# EAGLE design NodeMCU-Lora-Gateway (EAGLE 7.6.0)
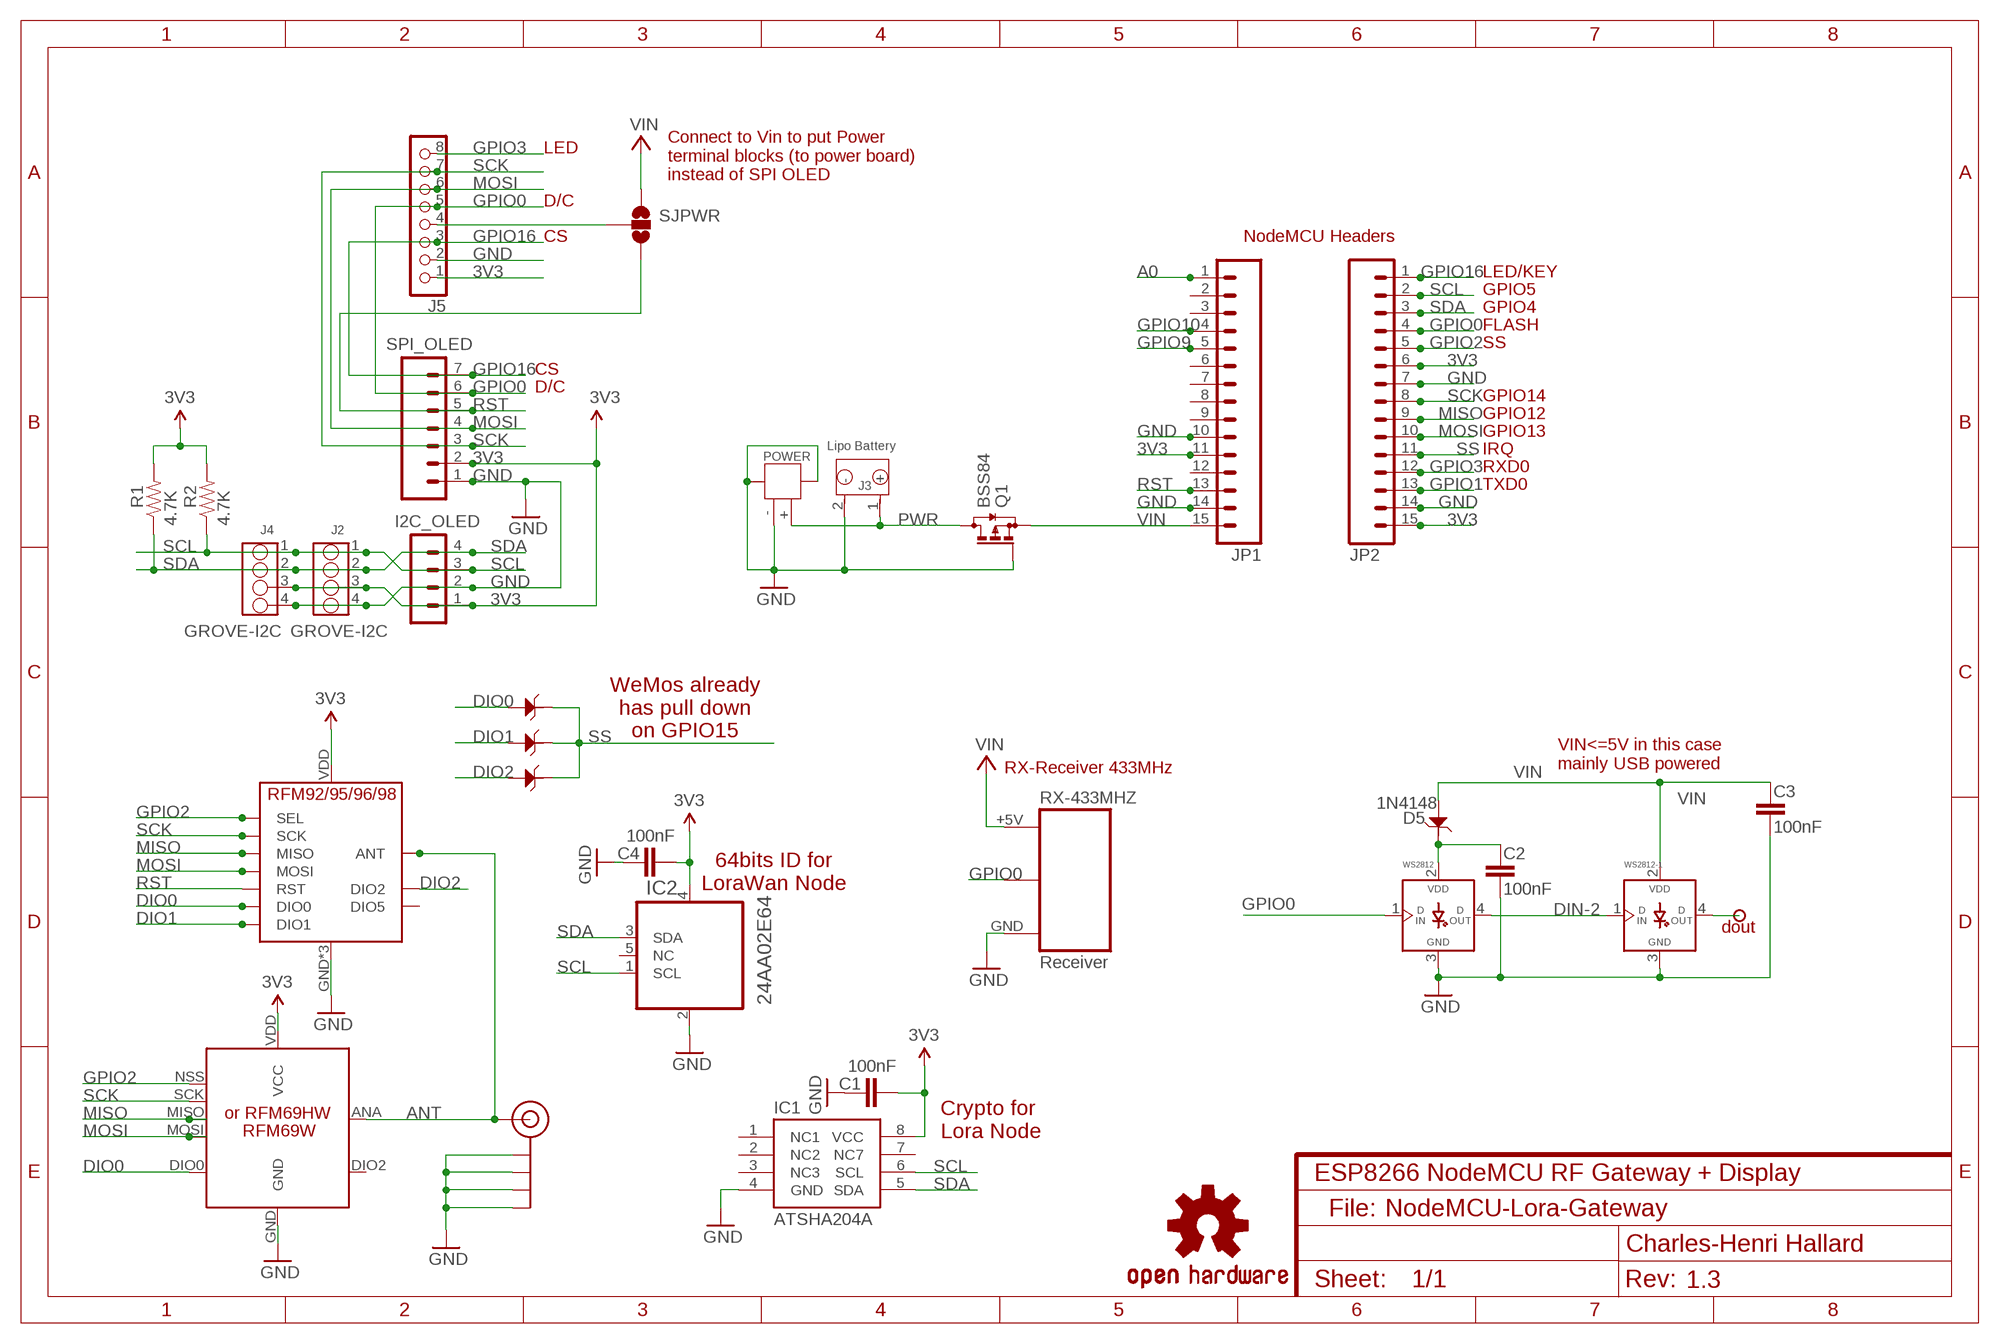
[diagram p0: schematic, sheet 1]
NAME (FRAME-A4L): CNAME: ESP8266 NodeMCU RF Gateway + Display; CREVISION: 1.3; DESIGNER: Charles-Henri Hallard

## Parts
C1  100nF  CAP0805-CAP  [0805-CAP]
C2  100nF  CAP0805-CAP  [0805-CAP]
C3  100nF  CAP0805-CAP  [0805-CAP]
C4  100nF  CAP0805-CAP  [0805-CAP]
D0  1N4148  D-ESD-2P-CESD5V0D1  [SOD123-2.7X1.6]
D1  1N4148  D-ESD-2P-CESD5V0D1  [SOD123-2.7X1.6]
D2  1N4148  D-ESD-2P-CESD5V0D1  [SOD123-2.7X1.6]
D5  1N4148  D-ESD-2P-CESD5V0D1  [SOD123-2.7X1.6]
I2C_OLED  CON_HEADER_1X04'LOCK'  [1X04_LOCK]
IC1  ATSHA204A  ATSHA204_SOIC8  [SOIC8]
IC2  24AA02E64  24AA02E64T-I/OT  [SOT95P270X145-5N]
J2  GROVE-I2C  GROVE-4P-2.0-3470140P1  [4P-2.0-90D]
J3  Lipo Battery  JST-2P-PW-3410070P1  [2P-2.0-90D]
J4  GROVE-I2C  GROVE-4P-2.0-3470130P1  [4P-2.0]
J5  CON_HEADER_1X08-PTH  [M1X8]
J$1  ANTENNATINY  [SMA_UFL_PAD_TINY]
JP1  M15LOCK  [1X15_LOCK]
JP2  M15LOCK  [1X15_LOCK]
LOGO2  OSHW-LOGOL  [OSHW-LOGO-L]
P2  PADNORMAL  [PAD]
POWER  JST-2P-SMD'2.0'  [2P-SMD-2.0-90D]
Q1  BSS84  [SOT23]
R1  4.7K  RESISTOR0805-RES  [0805-RES]
R2  4.7K  RESISTOR0805-RES  [0805-RES]
RX-433MHZ  Receiver  RF-LINK_RX  [RF-LINK_RX_NO_SILK]
SJPWR  JUMPER-PAD-3-2OF3_NC_BY_TRACE_LARGE  [PAD-JUMPER-3-2OF3_NC_BY_TRACE_YES_SILK_LARGE]
SPI_OLED  CON_HEADER_1X07'SMALL'  [M1X7]
U1  RFM9x  RFM95  [RFM95]
U$3  RFM69W  [RFM69W-MINPADS]
WS2812  WS2812B  WS2812B5MM  [WS2812-PTH]
WS2812-1  WS2812B  WS2812B5MM  [WS2812-PTH]

## Nets
3V3: C1.2 C4.2 I2C_OLED.1 IC1.8(VCC) IC2.4(VCC) J2.3 J4.3 J5.1 JP1.11 JP2.6 JP2.15 R1.2 R2.2 SPI_OLED.2 U1.VDD(VCC) U$3.VDD(VCC)
A0: JP1.1
ANT: J$1.ANT1(SIGNAL) J$1.ANT2(SIGNAL) J$1.ANT3(SIGNAL) U1.ANT U$3.ANA(ANT)
DIN-2: WS2812-1.1(DIN) WS2812.4(DOUT)
DIO0: D0.1 U1.DIO0 U$3.DIO0
DIO1: D1.1 U1.DIO1
DIO2: D2.1 U1.DIO2
GND: C1.1 C2.1 C3.1 C4.1 I2C_OLED.2 IC1.4(GND) IC2.2(VSS) J2.4 J3.2(-) J4.4 J5.2 J$1.GND1(GND) J$1.GND2(GND) J$1.GND3(GND) J$1.GND4(GND) JP1.10 JP1.14 JP2.7 JP2.14 POWER.3 POWER.4 POWER.- Q1.1(G) RX-433MHZ.GND SPI_OLED.1 U1.GND U1.GND1(GND) U1.GND2(GND) U$3.GND WS2812-1.3(GND) WS2812.3(GND)
GPIO0: J5.5 JP2.4 RX-433MHZ.DATA@1(DATA) RX-433MHZ.DATA@2(DATA) SPI_OLED.6 WS2812.1(DIN)
GPIO1: JP2.13
GPIO2: JP2.5 U1.NSS(SEL) U$3.NSS(SEL)
GPIO3: J5.8 JP2.12
GPIO9: JP1.5
GPIO10: JP1.4
GPIO16: J5.3 JP2.1 SPI_OLED.7
MISO: JP2.9 U1.MISO U$3.MISO
MOSI: J5.6 JP2.10 SPI_OLED.4 U1.MOSI U$3.MOSI
N$1: P2.1 WS2812-1.4(DOUT)
N$2: J5.4 SJPWR.2
PWR: J3.1(+) POWER.+ Q1.3(D)
RST: JP1.13 SJPWR.3 SPI_OLED.5 U1.RST
SCK: J5.7 JP2.8 SPI_OLED.3 U1.SCK U$3.SCK
SCL: I2C_OLED.3 IC1.6(SCL) IC2.1(SCL) J2.1 J4.1 JP2.2 R2.1
SDA: I2C_OLED.4 IC1.5(SDA) IC2.3(SDA) J2.2 J4.2 JP2.3 R1.1
SS: D0.2 D1.2 D2.2 JP2.11
VIN: C3.2 D5.1 JP1.15 Q1.2(S) RX-433MHZ.+5V SJPWR.1 WS2812-1.2(VDD)
VLED: C2.2 D5.2 WS2812.2(VDD)
Unconnected: IC1.1(NC1) IC1.2(NC2) IC1.3(NC3) IC1.7(NC7) IC2.5(NC) JP1.2 JP1.3 JP1.6 JP1.7 JP1.8 JP1.9 JP1.12 U1.DIO5 U$3.DIO2

## Notes on the sheet
- LED
- Connect to Vin to put Power
  terminal blocks (to power board)
  instead of SPI OLED
- D/C
- CS | NodeMCU Headers
- LED/KEY
- GPIO5
- GPIO4
- FLASH
- SS
- CS
- D/C
- GPIO14
- GPIO12
- GPIO13
- IRQ
- RXD0
- TXD0
- WeMos already
  has pull down
  on GPIO15
- VIN<=5V in this case
  mainly USB powered
- RX-Receiver 433MHz
- 64bits ID for
  LoraWan Node
- dout
- or RFM69HW
- Crypto for 
  Lora Node
- File:

## Library data of the parts
C1-C4 = _c2h:CAP: Capacitor Standard 0603 ceramic capacitor, and 0.1" leaded capacitor.
D0 D1 D2 D5 = Seeed-Discrete:D-ESD-2P: Diodes for Protectiong against ESD
I2C_OLED = _c2h:CON_HEADER_1X04
IC1 = SparkFun-DigitalIC:ATSHA204_SOIC8: ATSHA204; PROD_ID: IC-11981
IC2 = Microchip-24AA02E64T:24AA02E64T-I/OT: 2K I2C™ Serial EEPROMs, SOT23-5; MPN: 24AA02E64T-I/OT; OC_FARNELL: 2345567; OC_NEWARK: 01X0461; PACKAGE: SOT23-5; SUPPLIER: Microchip
J2 J4 = seeed-opl-Connector:GROVE-4P-2.0
J3 = Seeed-Connector:JST-2P-PW
J5 = dp_devices:CON_HEADER_1X08
J$1 = _c2h:ANTENNA: SMA Antenna Connector End launch SMA connector. The paste layer has been removed so that the connector can be hand soldered onto the board after reflow.
JP1 JP2 = SparkFun-Connectors:M15: Header 15 Standard 15-pin 0.1" header. Use with straight break away headers (SKU : PRT-00116), right angle break away headers (PRT-00553), swiss pins (PRT-00743), machine pins (PRT-00117), and female headers (PRT-00115).
LOGO2 = SparkFun-Aesthetics:OSHW-LOGO: Open Source Hardware Logo This logo indicates the piece of hardware it is found on incorporates a OSHW license and/or adheres to the definition of open source hardware found here: http://freedomdefined.org/OSHW
P2 = _c2h:PAD
POWER = Seeed-Connector:JST-2P-SMD: 2P-SMD-2.0-90D:320110026
Q1 = transistor-small-signal:BSS84: P-CHANNEL MOS FET
R1 R2 = _c2h:RESISTOR: Resistor Basic schematic elements and footprints for 0603, 1206, and PTH resistors.
RX-433MHZ = _c2h:RF-LINK_RX: RF Link receivers- WRL-8947, 8948, 8949, 8950, 10532, 10533
SJPWR = SparkFun-Passives:JUMPER-PAD-3-2OF3_NC_BY_TRACE
SPI_OLED = _c2h:CON_HEADER_1X07
U1 = _c2h:RFM95
U$3 = _c2h:RFM69W
WS2812 WS2812-1 = _c2h:WS2812B

## Net classes
0 default: width 0.203 mm, drill 0.356 mm, clearance 0.152 mm
1 power: width 0.203 mm, clearance 0.152 mm

## Board
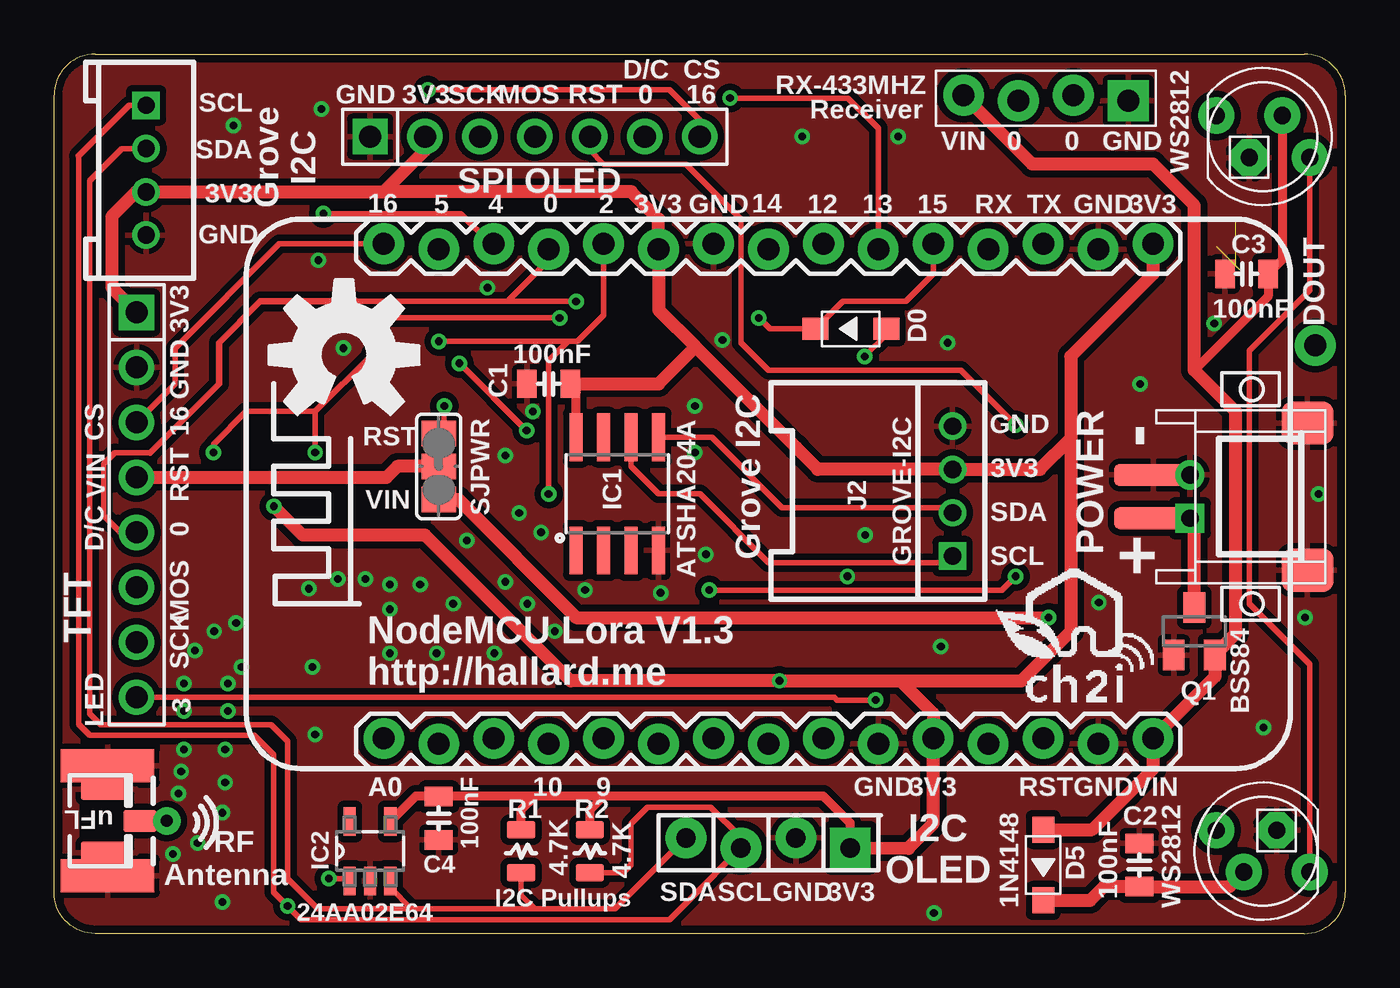
[diagram p1: board, top side]
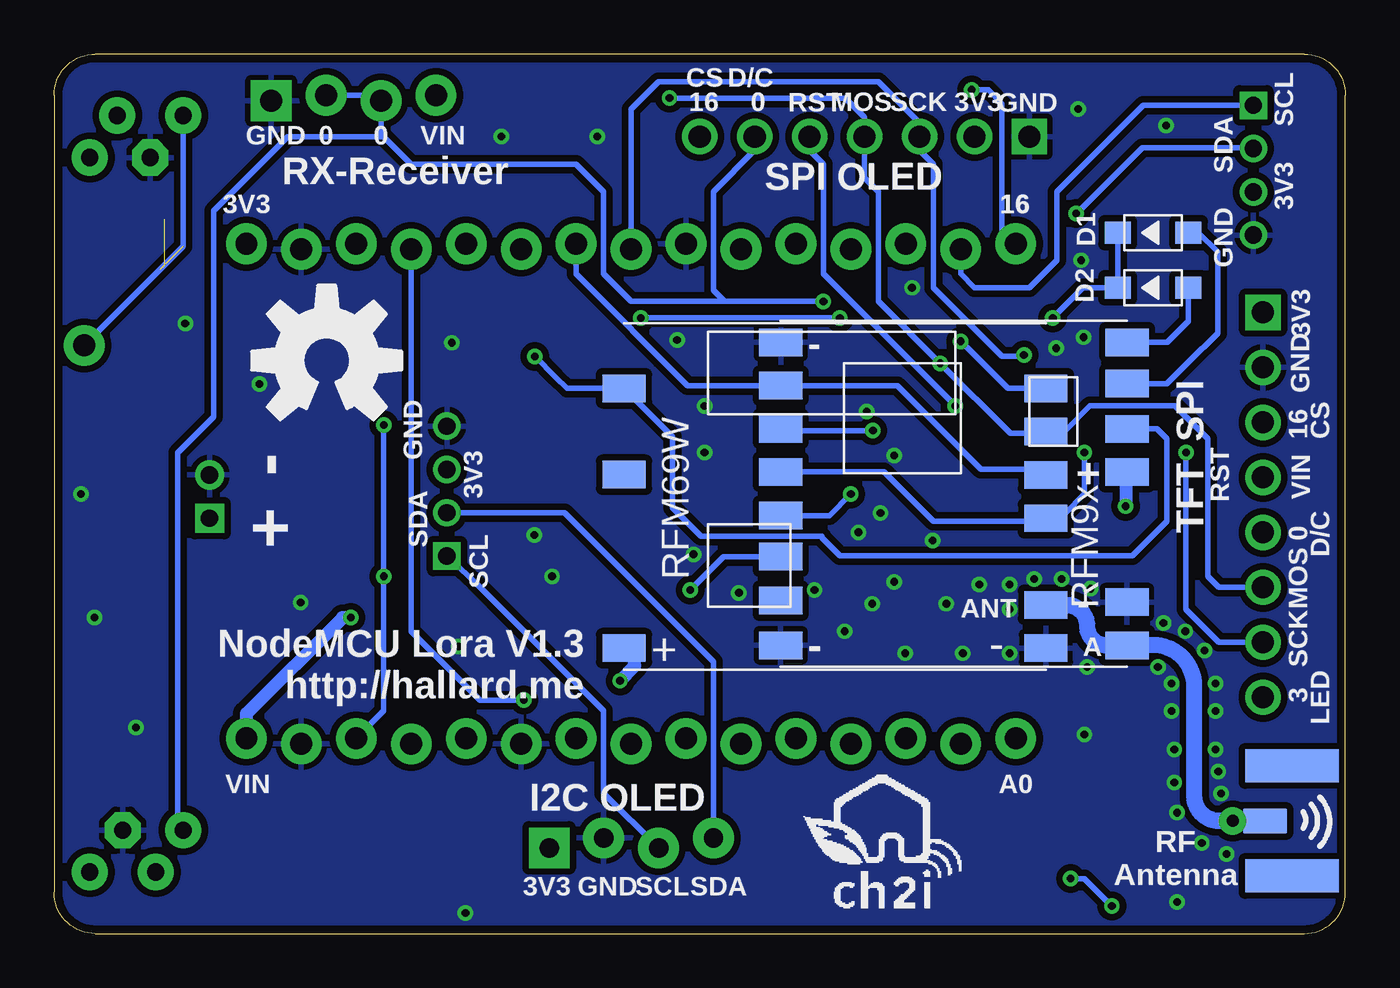
[diagram p2: board, bottom side, seen from below]

Size 59.69 x 40.64 mm. Coordinates in mm from the lower left corner, seen from the top.
Outline: 1.91,40.64 57.78,40.64 arc-90 59.69,38.73 59.69,1.91 arc-90 57.78,0 1.91,0 arc-90 0,1.91 0,38.73 arc-90 1.91,40.64
Copper layers (1*16): Top 0.0356mm / dielectric 1.5011mm / Bottom 0.0356mm
Design rules "PCBs_io": minimum track width 6mil, minimum drill 13mil, track to track 6mil, track to pad 6mil, pad to pad 6mil, via to via 6mil, smd to smd 6mil, copper to edge 15mil, drill to drill 6mil, minimum pad ring 7mil, minimum via ring 7mil, stop-mask expansion 3mil, vias tented up to drill 40mil, thermal gap 10mil

### Footprints (pad centres in the part's own frame; a part is rotated, then mirrored left to right if it is on the bottom)
0805-CAP = smd 0.902 x 1.3: 1 -1,0; 2 1,0
SOD123-2.7X1.6 = smd 1.2 x 1.02: 1 -1.635,0; 2 1.635,0
1X04_LOCK = drill 0.9 pad 1.88 square: 1 1.295,1.372 | drill 0.9 pad 1.88: 2 3.81,0.914; 3 6.35,1.372; 4 8.89,0.914
SOIC8 = smd 0.61 x 2.21: 1 -1.905,-2.616; 2 -0.635,-2.616; 3 0.635,-2.616; 4 1.905,-2.616; 5 1.905,2.616; 6 0.635,2.616; 7 -0.635,2.616; 8 -1.905,2.616
SOT95P270X145-5N = smd 1.321 x 0.559: 1 -1.372,0.94; 2 -1.372,0; 3 -1.372,-0.94; 4 1.372,-0.94; 5 1.372,0.94
4P-2.0-90D = drill 0.8 pad 1.27 square: 1 -3,0 | drill 0.8 pad 1.27: 2 -1,0; 3 1,0; 4 3,0
2P-2.0-90D = drill 0.8 pad 1.35 square: 1 -1,3.25 | drill 0.8 pad 1.35: 2 1,3.25
4P-2.0 = drill 0.8 pad 1.27 square: 1 -3,0 | drill 0.8 pad 1.27: 2 -1,0; 3 1,0; 4 3,0
M1X8 = drill 1.02 pad 1.632 square: 1 -8.89,0 | drill 1.02 pad 1.632: 2 -6.35,0; 3 -3.81,0; 4 -1.27,0; 5 1.27,0; 6 3.81,0; 7 6.35,0; 8 8.89,0
SMA_UFL_PAD_TINY = smd 1.524 x 1.016: ANT1 -3.843,0 | drill 0.559 pad 1.27: ANT2 -5.08,0 | smd 2.032 x 1.143 bottom: ANT3 -3.589,0 | smd 2.2 x 1.016: GND1 -2.223,1.47; GND2 -2.223,-1.47 | smd 4.318 x 1.524: GND3 -2.349,-2.54; GND4 -2.349,2.54 | smd 4.318 x 1.524 bottom: GND5 -2.349,2.54; GND6 -2.349,-2.54
1X15_LOCK = drill 1.016 pad 1.88: 1 0,0.127; 2 2.54,-0.127; 3 5.08,0.127; 4 7.62,-0.127; 5 10.16,0.127; 6 12.7,-0.127; 7 15.24,0.127; 8 17.78,-0.127; 9 20.32,0.127; 10 22.86,-0.127; 11 25.4,0.127; 12 27.94,-0.127; 13 30.48,0.127; 14 33.02,-0.127; 15 35.56,0.127
PAD = drill 1.016 pad 1.88: 1 0,0
2P-SMD-2.0-90D = smd 2 x 2.4: 3 3.4,-2.181; 4 -3.4,-2.181 | smd 1 x 3.6: + -1,4.953; - 1,4.953
SOT23 = smd 1 x 1.4: 1 -0.95,-1.1; 2 0.95,-1.1; 3 0,1.1
0805-RES = smd 0.8 x 1.3: 1 -1,0; 2 1,0
RF-LINK_RX_NO_SILK = drill 1.016 pad 1.88: +5V 7.62,1.143; DATA@1 2.54,1.143; DATA@2 5.08,1.397 | drill 1.016 pad 1.88 square: GND 0,1.397
PAD-JUMPER-3-2OF3_NC_BY_TRACE_YES_SILK_LARGE = smd 1.168 x 1.6: 1 -1.524,0; 2 0,0; 3 1.524,0
M1X7 = drill 1.02 pad 1.632 square: 1 -6.35,0 | drill 1.02 pad 1.632: 2 -3.81,0; 3 -1.27,0; 4 1.27,0; 5 3.81,0; 6 6.35,0; 7 8.89,0
RFM95 = smd 2 x 1.27: ANT 5.777,-7; DIO0 5.777,3; DIO1 5.779,5.095; DIO2 5.779,7; DIO5 -10.225,-4.936; GND 5.777,-5; GND1 -10.223,7; GND2 -10.23,-7; MISO -10.23,5; MOSI -10.225,3; NSS -10.223,-1; RST -10.223,-2.905; SCK -10.23,1.012; VDD 5.777,1
RFM69W-MINPADS = smd 2 x 1.27: ANA 8,-5; DIO0 -11.5,5; DIO2 -11.5,1.012; GND 8,-7; MISO 8,1; MOSI 8,3; NSS 8,5; SCK 8,-1; VDD -11.5,-7
WS2812-PTH = drill 0.8 pad 1.676: 1 2.159,-0.968; 2 0.889,0.968; 4 -2.159,0.968 | drill 0.8 pad 1.676 octagon: 3 -0.635,-0.968

### Placement (x,y rotation side)
C1  22.86,25.4 0 top
C2  50.16,3.17 270 top
C3  55.12,30.48 0 top
C4  17.78,5.33 90 top
D0  36.83,27.94 180 top
D1  8.89,32.38 180 bottom
D2  8.89,29.84 180 bottom
D5  45.72,3.17 270 top
I2C_OLED  38.1,5.33 180 top
IC1  26.04,20.32 0 top
IC2  14.61,3.81 90 top
J2  41.53,20.45 90 top
J3  55.75,20.19 90 top
J4  4.25,35.27 270 top
J5  3.81,19.81 270 top
J$1  0.13,5.21 180 top
JP1  15.24,8.89 0 top
JP2  15.24,31.75 0 top
LOGO1  OSHW-LOGOL  [OSHW-LOGO-L]  13.4,26.73 0 top
LOGO2  47.09,26.48 0 bottom
P2  58.29,27.18 0 top
POWER  55.75,20.19 90 top
Q1  52.7,13.97 0 top
R1  21.59,3.81 90 top
R2  24.77,3.81 90 top
RX-433MHZ  49.66,39.88 180 top
SJPWR  17.78,21.59 90 top
SPI_OLED  20.95,36.83 0 top
U1  15.88,20.32 0 bottom
U$1  [LOGO_CH2I_75MM]  47.62,12.7 0 top
U$3  21.84,20.19 0 bottom
U$4  [LOGO_CH2I_75MM]  20.95,3.17 0 bottom
WS2812  55.88,3.81 180 top
WS2812-1  55.88,36.83 0 top

### Tracks (layer width: path | path; a pad name or v marks a point on that pad's centre or on a via)
3V3  (via drill 0.36 pad 0.61, 0.36 pad 0.71)
  Top 0.254: 29.32,27.43 29.65,27.11
  Top 0.305: R2.2 24.5,4.81
  Top 0.406: IC1.8 24.13,25.04 C1.2 | I2C_OLED.1 36.8,5.11 35.56,6.35 25.4,6.35 | 25.4,6.35 22.23,6.35 | 22.23,6.35 17.78,6.35 | 17.78,6.35 16.71,6.35 IC2.4 | C4.2 17.78,6.35 | R1.2 21.59,5.71 22.23,6.35 | R2.2 24.77,5.71 25.4,6.35
  Top 0.61: I2C_OLED.1 39.5,3.94 40.64,5.08 JP1.11 40.64,10.16 39.12,11.68 | 15.24,34.29 17.14,36.2 SPI_OLED.2 | 15.24,34.29 26.67,34.29 27.94,33.02 JP2.6 27.94,28.81 29.65,27.11 | 15.24,34.29 15.22,34.27 J4.3 3.79,34.27 2.67,33.15 2.67,29.84 J5.1 | 29.65,27.11 34.29,22.46 | 39.12,11.68 v33.53,11.68 23.88,11.68 17.14,18.41 11.49,18.41 v10.16,19.75 | 34.29,22.46 34.31,22.46 | 34.29,22.46 35.31,21.45 J2.3 45.58,21.45 46.99,22.86 | JP2.15 50.8,30.48 46.99,26.67 46.99,22.86 | 46.99,22.86 46.99,13.97 44.7,11.68 39.12,11.68 | C1.2 27.94,25.4 29.65,27.11
  Bottom 0.61: U$3.VDD 32.85,13.21 32.85,12.38 v33.53,11.68 | U1.VDD 10.16,21.26 v10.16,19.75
ANT
  Top 0.61: J$1.ANT2 J$1.ANT1
  Bottom 0.61: J$1.ANT3 J$1.ANT2
  Bottom 0.75: J$1.ANT2 5.84,5.21 arc90 6.99,6.35 6.99,11.43 arc-90 8.89,13.34 10.08,13.34 arc-90 U1.ANT 11.03,13.32 arc90 11.94,14.22 arc-90 12.91,15.19 U$3.ANA
DIN-2
  Top 0.254: WS2812.4 58.04,12.45 55.24,15.24 55.24,26.92 58.04,29.72 WS2812-1.1
DIO0  (via drill 0.36 pad 0.71)
  Top 0.254: D0.1 38.47,27.67 v37.47,26.67
  Bottom 0.254: U1.DIO0 8.71,23.32 8.26,22.86 8.26,19.05 9.84,17.46 23.37,17.46 24.19,18.29 24.19,18.35 29.78,18.35 31.11,19.68 31.11,22.96 U$3.DIO0 35.99,25.19 36.51,25.72 v37.47,26.67
DIO1
  Bottom 0.254: U1.DIO1 10.08,25.4 8.26,25.4 7.62,26.04 7.25,26.4 5.91,27.75 5.91,31.5 6.79,32.38 D1.1
DIO2
  Bottom 0.254: U1.DIO2 8.24,27.32 7.25,28.3 D2.1
GND  (via drill 0.36 pad 0.71)
  other vias: 41.31,27.3 7.78,1.46 40.67,0.95 22.51,18.54 18.45,15.24 12.22,31.11 12.06,9.21 48.29,15.3 39.02,36.83 55.91,9.53 12.35,38.1 36.67,16.51 30.89,27.43 12.1,27.56 8.29,37.34 29.62,24.38 37.5,18.41 20.03,29.84 40.99,13.27 5.49,3.68 6.64,4.19 7.78,5.59 7.91,6.99 7.91,8.51 6,8.51 5.87,7.49 6,10.29 8.03,10.29 6,11.56 8.03,11.56 6.51,13.08 7.4,13.97 8.41,14.35 8.67,12.32 5.75,6.48 13.11,16.38 14.38,16.38 15.53,16.13 15.53,14.99 11.94,12.32 11.78,15.94 15.53,12.95 16.92,16.13 20.86,16.26 21.88,15.24 23.15,13.97 19.08,18.16 24.54,15.88 28.04,15.75 30.13,17.53 20.86,22.1 13.37,27.05 29.62,22.23 17.68,12.95 20.35,12.95 21.49,19.43 53.63,28.19 34.58,36.83 22.13,24.13 50.2,25.4 58.45,20.32 57.82,14.61
  pour Bottom (isolate 0.305): 61.59,41.91 61.59,-1.27 -1.14,-1.4 -1.14,41.78
  pour Top (isolate 0.305): 0.13,41.15 60.96,41.27 60.33,-0.64 -0.51,-0.76
GPIO0  (via drill 0.36 pad 0.71)
  Top 0.254: 20.95,29.21 v24.13,29.21 | JP2.4 22.86,31.11 20.95,29.21 | 20.95,29.21 13.97,29.21 | 4.45,22.23 2.79,22.23 2.29,21.72 2.29,19.3 3.05,18.54 J5.5
  Top 0.305: 4.45,22.23 7.62,25.4 7.62,27.3 9.53,29.21 13.97,29.21
  Bottom 0.254: SPI_OLED.6 27.3,36.2 29.21,34.29 29.21,29.72 28.7,29.21 | 28.7,29.21 v24.13,29.21 | 44.45,36.83 44.58,36.96 RX-433MHZ.DATA@2 44.83,38.73 RX-433MHZ.DATA@1 | 44.45,36.83 43.18,35.56 35.56,35.56 34.29,34.29 34.29,30.48 33.02,29.21 28.7,29.21 | 44.45,36.83 48.9,36.83 52.32,33.4 52.32,23.88 53.98,22.23 53.98,5.03 WS2812.1
GPIO2  (via drill 0.36, 0.36 pad 0.71)
  Top 0.254: v17.78,27.37 23.75,27.37 | JP2.5 25.4,28.57 24.19,27.37 23.75,27.37 | v22.86,20.32 22.86,26.48 23.75,27.37
  Bottom 0.254: U$3.NSS 15.6,25.19 v17.78,27.37 | U1.NSS 23.86,19.32 v22.86,20.32
GPIO3  (via drill 0.36 pad 0.71)
  Top 0.254: J5.8 36.07,10.92 36.2,10.79 v37.97,10.79
  Bottom 0.254: v37.97,10.79 40.01,10.79 43.18,13.97 JP2.12
GPIO16  (via drill 0.36 pad 0.71)
  Top 0.254: JP2.1 10.41,31.88 5.59,27.05 5.59,25.4 J5.3 | SPI_OLED.7 29.84,37.59 28.45,38.99 v17.27,38.99
  Bottom 0.254: v17.27,38.99 16.51,38.99 15.88,38.35 15.88,32.51 JP2.1
MISO
  Bottom 0.254: 14.11,21.46 16.86,21.46 20.72,25.32 U1.MISO 30.4,25.32 35.56,30.48 JP2.9
  Bottom 0.406: 14.11,21.46 U$3.MISO
MOSI  (via drill 0.36, 0.36 pad 0.71)
  Top 0.254: v31.24,38.61 36.7,38.61 38.1,37.21 JP2.10 | v21.84,23.24 v18.73,26.35
  Bottom 0.254: 13.92,23.11 15.49,23.11 v18.73,26.35 21.59,29.21 21.59,34.29 22.23,34.92 SPI_OLED.4 22.23,37.72 23.11,38.61 v31.24,38.61 | J5.6 5.84,16 6.35,16.51 6.35,22.86 7.87,24.38 11.81,24.38 12.95,23.24 13.8,23.24 | 25.92,23.5 U1.MOSI 26.02,23.24 v21.84,23.24
  Bottom 0.406: 13.8,23.24 U$3.MOSI 13.92,23.11
N$1  (3 unrouted)
  Bottom 0.254: P2.1 53.72,31.75 WS2812-1.4
N$2
  Top 0.61: SJPWR.2 15.88,21.59 15.37,21.08 J5.4
PWR
  Top 0.61: Q1.3 52.7,18.99 J3.1 POWER.+
RST  (via drill 0.36 pad 0.71)
  Top 0.254: SPI_OLED.5 24.77,36.2 25.4,35.56 29.21,35.56 31.75,33.02 31.75,27.3 33.02,26.04 41.91,26.04 v44.45,23.5 | SJPWR.3 18.03,23.11 v18.03,24.38 | v30.29,15.88 43.81,15.88 v44.45,16.51
  Bottom 0.254: SPI_OLED.5 24.77,36.2 24.13,35.56 24.13,30.48 v18.03,24.38 | v44.45,23.5 v44.45,16.51 44.45,10.29 JP1.13 | U1.RST 28.75,17.41 v30.29,15.88
SCK  (via drill 0.36, 0.36 pad 0.71)
  Top 0.254: v14.86,26.73 14.67,26.73 12.06,24.13 | 12.06,24.13 v12.06,22.23 | v7.37,22.23 7.37,22.61 8.89,24.13 12.06,24.13
  Bottom 0.254: JP2.8 33.02,38.1 31.75,39.37 21.59,39.37 19.68,37.47 SPI_OLED.3 19.68,36.2 19.05,35.56 19.05,29.84 15.88,26.67 14.92,26.67 v14.86,26.73 | J5.7 5.84,13.46 7.37,14.99 v7.37,22.23 | U$3.SCK 13.84,19.43 12.95,19.43 12.06,20.32 v12.06,22.23 | 13.97,19.07 U$3.SCK | U1.SCK 21.33,21.33 19.05,19.05 13.99,19.05 U$3.SCK
SCL  (via drill 0.36 pad 0.71)
  Top 0.254: J4.1 3.48,38.27 1.97,36.77 | IC1.6 26.67,21.59 27.94,20.32 29.84,20.32 33.02,17.14 41.23,17.14 J2.1 | 1.14,35.94 1.14,9.68 1.65,9.18 9.24,9.18 10.16,8.26 10.16,1.91 v10.79,1.27 11.43,0.64 28.45,0.64 29.34,1.55 I2C_OLED.3 31.75,4.45 30.35,5.84 27.43,5.84 26.67,5.08 26.67,3.17 26.3,2.81 R2.1 | v12.7,2.54 13.56,2.54 IC2.1
  Top 0.305: 1.14,35.94 1.97,36.77
  Bottom 0.254: J4.1 9.35,38.27 13.34,34.29 13.34,31.11 14.61,29.84 17.14,29.84 17.78,30.48 JP2.2 | I2C_OLED.3 34.29,6.48 34.29,10.29 40.26,16.26 J2.1 | v12.7,2.54 12.06,2.54 v10.79,1.27
SDA  (via drill 0.36 pad 0.71)
  Top 0.254: J4.2 3.13,36.27 1.65,34.8 1.65,10.16 2.16,9.65 10.03,9.65 10.79,8.89 10.79,2.54 12.19,1.14 16.51,1.14 | JP2.3 20.19,31.88 18.8,33.27 v12.45,33.27 | 21.45,2.81 R1.1 21.59,1.78 22.23,1.14 | IC1.5 30.4,22.94 33.66,19.68 41.29,19.68 J2.2 | I2C_OLED.4 25.93,1.14 22.23,1.14 | 22.23,1.14 16.51,1.14 | IC2.3 15.54,2.11 16.51,1.14
  Bottom 0.254: J4.2 4.3,36.32 9.4,36.32 v12.45,33.27 | I2C_OLED.4 29.21,12.57 36.08,19.45 J2.2
SS  (via drill 0.36 pad 0.71)
  Top 0.254: v13.53,28.45 v23.37,28.45 | v32.58,28.45 33.08,27.94 D0.2 36.47,29.21 39.37,29.21 40.64,30.48 JP2.11
  Bottom 0.254: v13.53,28.45 12.13,29.84 D2.2 D1.2 | v23.37,28.45 v32.58,28.45
VIN  (via drill 0.36 pad 0.71)
  Top 0.406: WS2812-1.2 56.77,31.13 C3.2 56.12,29.45 52.7,26.04
  Top 0.61: RX-433MHZ.+5V 45.21,35.56 50.8,35.56 52.7,33.66 52.7,26.04 54.61,24.13 54.61,13.82 Q1.2 53.66,11.87 JP1.15 50.8,7.62 47.99,4.81 D5.1 | v45.97,14.61 24.13,14.61 18.67,20.07 SJPWR.1
  Bottom 0.61: v45.97,14.61 46.35,14.61 50.8,10.16 JP1.15
VLED
  Top 0.61: WS2812.2 54.32,2.17 C2.2 48.53,2.17 47.9,1.54 D5.2

### Text on the board
tNames: D/C | CS | WS2812 | SCL | GND | 3V3 | SCK | MOS | 0 | 16 | RST | SDA | Grove / I2C | VIN | 0 | 0 | GND | 3V3 | SPI OLED | 16 | 5 | 4 | 0 | 2 | 3V3 | GND | 14 | 12 | 13 | 15 | RX | TX | GND | 3V3 | GND | 3V3 | DOUT | GND | CS | Grove I2C | 16 | RST | GND | - | VIN | RST | 3V3 | D/C | VIN | 0 | SDA | + | TFT | MOS | SCL | SCK | LED | 3 | NodeMCU Lora V1.3 / http://hallard.me | A0 | A0 | 10 | 9 | GND | 3V3 | RST | GND | VIN | I2C / OLED | RF / Antenna | I2C Pullups | SDA | SCL | GND | 3V3
bNames: GND | 3V3 | SCK | MOS | 0 | D/C | 16 | CS | RST | SCL | 3V3 | RX-Receiver | VIN | 0 | 0 | GND | SDA | GND | SPI OLED | 16 | 16 | 3V3 | 3V3 | TFT SPI | GND | GND | CS | 16 | - | RST | VIN | 3V3 | SDA | + | 0 | SCL | D/C | MOS | NodeMCU Lora V1.3 / http://hallard.me | SCK | 3 | LED | A0 | I2C OLED | VIN | RF / Antenna | SDA | SCL | GND | 3V3